# Altium project NIR_Spectroscopy.PrjPcb
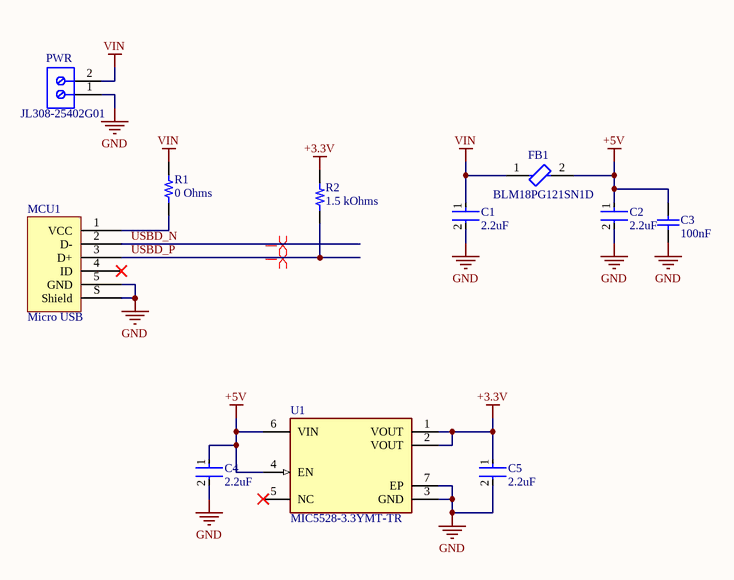
[diagram p0: Power.SchDoc]
4 sheets, 55 parts. Net scope: global (net labels, ports and power ports of the same name join across sheets).
Board file: Spectroscopy Board Rev1.PcbDoc
Sheets:
  Power.SchDoc
  uC.SchDoc
  ADC.SchDoc
  Photodiode Receiver.SchDoc

## Sheet Power.SchDoc
size A; SheetNumber: 1; SheetTotal: 2

### Parts
C1  2.2uF  [FP-CL10-IPC_A]
C2  2.2uF  [FP-CL10-IPC_A]
C3  100nF  [CAPC1050X55X23ML05T13]
C4  2.2uF  [FP-CL10-IPC_A]
C5  2.2uF  [FP-CL10-IPC_A]
FB1  BLM18PG121SN1D  [FP-BLM18-0_15-t0_8-IPC_A]
MCU1  Micro USB  [FCI USB 10118193-0001LF]
PWR  JL308-25402G01  [691210910002]
R1  0 Ohms  [RES 0805_2012]
R2  1.5 kOhms  [RES 0402_1005]
U1  MIC5528-3.3YMT-TR  [FP-TDFN1212-6LD-PL-1-MFG]

### Nets
+3.3V: C5.1 R2.2 U1.1(VOUT) U1.2(VOUT)
+5V: C2.1 C3.2 C4.1 FB1.2 U1.4(EN) U1.6(VIN)
GND: C1.2 C2.2 C3.1 C4.2 C5.2 MCU1.5(GND) MCU1.S(Shield) PWR.1 U1.3(GND) U1.7(EP)
VIN: C1.1 FB1.1 PWR.2 R1.1
USBD_N: MCU1.2(D-)
USBD_P: MCU1.3(D+) R2.1
NetMCU1_1: MCU1.1(VCC) R1.2

Not connected (* = marked no-connect by the designer): MCU1 4(ID)*; U1 5(NC)*

### Layout directives
differential pair: (no net found under the mark)

### Library data of the parts
C1 C2 C4 C5 = CMP-13271-000835-1: Cap Ceramic 2.2uF 16V X5R ±10% Pad SMD 0603 +85°C T/R; Case Code (Metric): 1608; Height: 0.8mm; Case/Package: 0603; Depth: 0.8mm; Capacitance: 2.2uF; Voltage Rating: 16V; Case Code (Imperial): 0603; Length: 1.6mm; Packaging: Tape and Reel; Material: Ceramic; Lead Free: Lead Free; Max Operating Temperature: 85°C; Contact Plating: Tin; Thickness: 0.035inch; Radiation Hardening: No; Tolerance: 10%; Min Operating Temperature: -55°C; Voltage: 16V; Dielectric: X5R; Mount: Surface Mount; Package Quantity: 4000; Width: 0.031inch; Voltage Rating (DC): 16V
C3 = CMP-2000-05439-1: Chip Capacitor, 100 nF, +/- 10%, 16 V, -55 to 125 degC, 0402 (1005 Metric), RoHS, Tape and Reel; Manufacturer: Samsung Electro-Mechanics; Capacitance: 100000pF; Dielectric: X7R; Rated Voltage: 16V; Case Size/Dimension: 0402; Tolerance (%): ±10%; Manufacturer URL: http://www.samsungsem.com/global/index.jsp; Datasheet URL: https://datasheet.ciiva.com/29198/458718-da-01-en-vs-kondensator-0402-29198423.pdf; Datasheet Version: Nov-10
FB1 = CMP-0686-00557-7: Chip Ferrite Bead, 0603, 120Ω @ 100MHz, 0.05Ω, 25%, 2A; Impedance: 120R; Number of Circuits: 1; Shielding: Unshielded; Material: Steel; DC Resistance (DCR): 50mR; Case Code (Imperial): 0603; RoHS Compliant: Yes; Number of Pins: 2; Min Operating Temperature: -55°C; Case Code (Metric): 1608; Frequency: 100MHz; Length: 1.6mm; Test Frequency: 100MHz; Max Operating Temperature: 125°C; Packaging: Tape and Reel; Max Current Rating: 2A; Termination: SMD/SMT; Lead Free: Lead Free; Max DC Current: 2A; Case/Package: 0603; Height: 0.8mm; Current Rating: 2A; Radiation Hardening: No; Core Material: Ferrite; DC Current: 2A; REACH SVHC: No SVHC; Package Quantity: 1; Depth: 0.8mm; Number of Lines: 1; Tolerance: 25%; Width: 0.8mm
MCU1 = 10118193-0001LF: CONN RCPT USB2.0 MICRO B SMD R/A; Manufacturer: Amphenol ICC (FCI); Connector Type: USB - micro B; Current Rating (Amps): 1.8A per Contact; Gender: Receptacle; Mating Cycles: 10000; Number of Contacts: 5; Number of Ports: 1; Shielding: Shielded; Voltage - Rated: 100VAC; Part Number: 10118193-0001LF; ComponentLink1Description: Datasheet; ComponentLink1URL: https://cdn.amphenol-icc.com/media/wysiwyg/files/documentation/datasheet/inputoutput/io_usb_micro.pdf; ComponentLink2Description: DigiKey Link; ComponentLink2URL: //digikey.com/product-detail/en/amphenol-icc-fci/10118193-0001LF/609-4616-2-ND/2785388; Features: Solder Retention; LastUpdated: 12/9/2019 8:51:28 PM; Lifecycle Status: 0; Minimum Order: 1; Mounting Feature: Horizontal; Mounting Type: Surface Mount, Right Angle; Through Hole; Operating Temperature: -30°C ~ 80°C; Packaging: TapeAndReel; Part Status: Active; Price: 0.21; Series: -; Specifications: USB 2.0; Supplier 1: DigiKey; Supplier Part Number 1: 609-4616-2-ND; Termination: Solder
PWR = CMP-1502-02456-2: Use comment for part number; NexarPartId: 105950649; Current Rating: 6A; Voltage Rating: 150V; Number of Contacts: 2; Number of Rows: 1; Contact Material: Tin; Height: 8.7mm; Max Operating Temperature: 105°C; Min Operating Temperature: -40°C
R1 = TLRZ2ATTD: 0805 0 ohm - use 0805W8F0000T5E; Manufacturer: KOA Speer Electronics, Inc.; Tolerance: Jumper; Part Number: TLRZ2ATTD; Value: 0 Ohms; ComponentLink1Description: Datasheet; ComponentLink1URL: http://www.koaspeer.com/catimages/Products/TLRZ/TLRZ.pdf; ComponentLink2Description: DigiKey Link; ComponentLink2URL: https://www.digikey.com/en/products/detail/koa-speer-electronics-inc/TLRZ2ATTD/9845494; Composition: Metal Element; Device Package: 0805 (2012 Metric); Features: Automotive AEC-Q200, Current Sense; Height - Seated (Max): 0.022" (0.55mm); LastUpdated: 2/8/2024 9:02:39 PM; Lifecycle Status: Active; Minimum Order: 1; Number of Terminations: 2; Operating Temperature: -55°C ~ 170°C; Package / Case: 0805 (2012 Metric); Packaging: TapeAndReel; PartId: 27685; Part Status: Active; Price: 0.08; Ratings: AEC-Q200; Resistance: 0 Ohms; Series: TLRZ; Size / Dimension: 0.079" L x 0.049" W (2.00mm x 1.25mm); Supplier 1: DigiKey; Supplier Part Number 1: 2019-TLRZ2ATTDCT-ND; Supplier Device Package: 0805
R2 = RMCF0402FT1K50: RES 1.5K OHM 1% 1/16W 0402; Manufacturer: Stackpole Electronics Inc; Power (Watts): 0.063W, 1/16W; Temperature Coefficient: ±100ppm/°C; Part Number: RMCF0402FT1K50; Value: 1.5 kOhms; ComponentLink1Description: Datasheet; ComponentLink1URL: https://www.seielect.com/catalog/sei-rmcf_rmcp.pdf; ComponentLink2Description: DigiKey Link; ComponentLink2URL: https://www.digikey.com/en/products/detail/stackpole-electronics-inc/RMCF0402FT1K50/1761791; Composition: Thick Film; Device Package: 0402 (1005 Metric); Features: Automotive AEC-Q200; Height - Seated (Max): 0.016" (0.40mm); LastUpdated: 2/9/2024 8:30:13 PM; Lifecycle Status: Active; Minimum Order: 1; Number of Terminations: 2; Operating Temperature: -55°C ~ 155°C; Package / Case: 0402 (1005 Metric); Packaging: CutTape; PartId: 4934; Part Status: Active; Price: 0.01; Ratings: AEC-Q200; Resistance: 1.5 kOhms; Series: RMCF; Size / Dimension: 0.039" L x 0.020" W (1.00mm x 0.50mm); Supplier 1: DigiKey; Supplier Part Number 1: RMCF0402FT1K50CT-ND; Supplier Device Package: 0402; Tolerance: ±1%
U1 = CMP-06324-000078-1: IC REG LINEAR 3.3V 500MA 6TDFN; Dropout Voltage: 260mV; Number of Regulators: 1; Min Current Limit: 525mA; Output Current: 500mA; Output Voltage: 3.3V; Max Operating Temperature: 125°C; Packaging: Tape and Reel; Mount: Surface Mount; Min Operating Temperature: -40°C

## Sheet uC.SchDoc
size A; SheetNumber: 2; SheetTotal: 5
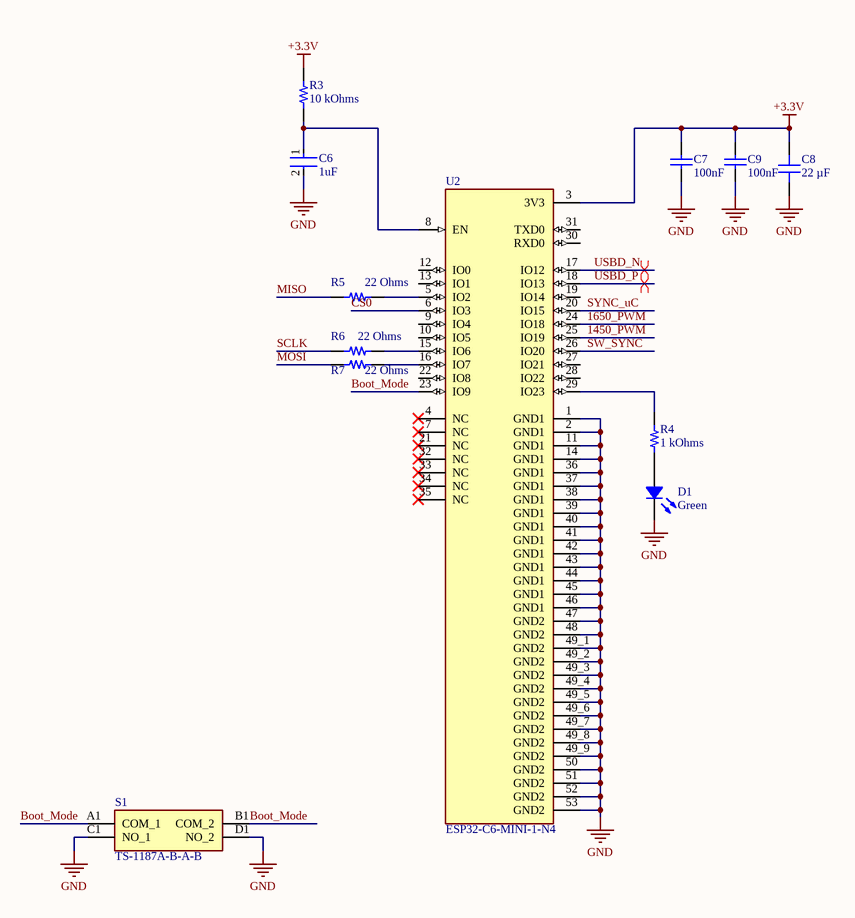
[diagram p1: uC.SchDoc]

### Parts
C6  1uF  [FP-CL542-IPC_C]
C7  100nF  [CAPC1050X55X23ML05T13]
C8  22 µF  [CAP 0603_1608]
C9  100nF  [CAPC1050X55X23ML05T13]
D1  Green  [LED 0805_2012 GREEN]
R3  10 kOhms  [RES 0402_1005]
R4  1 kOhms  [RES 0402_1005]
R5  22 Ohms  [RES 0402_1005]
R6  22 Ohms  [RES 0402_1005]
R7  22 Ohms  [RES 0402_1005]
S1  TS-1187A-B-A-B  [TS1187ABAB]
U2  ESP32-C6-MINI-1-N4  [XCVR_ESP32-C6-MINI-1-N4]

### Nets
+3.3V: C7.2 C8.2 C9.2 R3.2 U2.3(3V3)
GND: C6.2 C7.1 C8.1 C9.1 D1.2 S1.C1(NO_1) S1.D1(NO_2) U2.1(GND1) U2.2(GND1) U2.11(GND1) U2.14(GND1) U2.36(GND1) U2.37(GND1) U2.38(GND1) U2.39(GND1) U2.40(GND1) U2.41(GND1) U2.42(GND1) U2.43(GND1) U2.44(GND1) U2.45(GND1) U2.46(GND1) U2.47(GND2) U2.48(GND2) U2.49_1(GND2) U2.49_2(GND2) U2.49_3(GND2) U2.49_4(GND2) U2.49_5(GND2) U2.49_6(GND2) U2.49_7(GND2) U2.49_8(GND2) U2.49_9(GND2) U2.50(GND2) U2.51(GND2) U2.52(GND2) U2.53(GND2)
1450_PWM: U2.25(IO19)
1650_PWM: U2.24(IO18)
Boot_Mode: S1.A1(COM_1) S1.B1(COM_2) U2.23(IO9)
CS0: U2.6(IO3)
MISO: R5.1
MOSI: R7.1
SCLK: R6.1
SW_SYNC: U2.26(IO20)
SYNC_uC: U2.20(IO15)
USBD_N: U2.17(IO12)
USBD_P: U2.18(IO13)
NetC6_1: C6.1 R3.1 U2.8(EN)
NetD1_1: D1.1 R4.1
NetR4_2: R4.2 U2.29(IO23)
NetR5_2: R5.2 U2.5(IO2)
NetR6_2: R6.2 U2.15(IO6)
NetR7_2: R7.2 U2.16(IO7)

Not connected (* = marked no-connect by the designer): U2 4(NC)* 7(NC)* 9(IO4) 10(IO5) 12(IO0) 13(IO1) 19(IO14) 21(NC)* 22(IO8) 27(IO21) 28(IO22) 30(RXD0) 31(TXD0) 32(NC)* 33(NC)* 34(NC)* 35(NC)*

### Layout directives
differential pair: USBD_N, USBD_P

### Library data of the parts
C6 = CMP-13271-001051-1: Cap Ceramic 1uF 25V X5R ±10% SMD 0402 +85°C Paper T/R; Radiation Hardening: No; Lead Free: Lead Free; Capacitance: 1uF; Package Quantity: 10000; Max Operating Temperature: 85°C; Voltage Rating: 25V; Case/Package: 0402; Min Operating Temperature: -55°C; Packaging: Tape and Reel; Tolerance: 10%; Height: 0.5mm; Thickness: 0.022inch; Case Code (Metric): 1005; Width: 0.02inch; Case Code (Imperial): 0402; Dielectric: X5R; Length: 1mm; Mount: Surface Mount; Material: Ceramic; Depth: 0.5mm
C7 C9 = CMP-2000-05439-1: as C3 on sheet Power; Case Size/Dimension: 0402; Tolerance (%): ±10%; Manufacturer URL: http://www.samsungsem.com/global/index.jsp; Datasheet URL: https://datasheet.ciiva.com/29198/458718-da-01-en-vs-kondensator-0402-29198423.pdf; Datasheet Version: Nov-10
C8 = CL10A226KQ8NRNE: CAP CER 22UF 6.3V X5R 0603; manufacturer: Samsung Electro-Mechanics; Tolerance: ±10%; Part Number: CL10A226KQ8NRNE; Value: 22 µF; Applications: General Purpose; Capacitance: 22 µF; componentlink1description: Datasheet; componentlink1url: http://www.samsungsem.com/kr/support/product-search/mlcc/CL10A226KQ8NRNE.jsp; componentlink2description: DigiKey Link; componentlink2url: https://www.digikey.com/en/products/detail/samsung-electro-mechanics/CL10A226KQ8NRNE/3888525; Device Package: 0603 (1608 Metric); lastupdated: 2/9/2024 8:10:30 PM; Lifecycle Status: Active; Minimum Order: 1; Mounting Type: Surface Mount, MLCC; Operating Temperature: -55°C ~ 85°C; Package / Case: 0603 (1608 Metric); packaging: TapeAndReel; partid: 2682; Part Status: Active; price: 0.10; series: CL; Size / Dimension: 0.063" L x 0.031" W (1.60mm x 0.80mm); Supplier 1: DigiKey; Supplier Part Number 1: 1276-2867-1-ND; Temperature Coefficient: X5R; Thickness (Max): 0.035" (0.90mm); Voltage - Rated: 6.3V
D1 = SM0805GC: LED GREEN CLEAR 0805 SMD KT0805G; Manufacturer: Bivar Inc.; Configuration: Standard; Current - Test: 20mA; Lens Color: Colorless; Lens Size: 1.40mm x 1.20mm; Lens Style: Rectangle with Flat Top; Millicandela Rating: 15mcd; Viewing Angle: 130°; Voltage - Forward (Vf) (Typ): 2.1V; Wavelength - Dominant: 565nm; Wavelength - Peak: 568nm; Part Number: SM0805GC; Color: Green; ComponentLink1Description: Datasheet; ComponentLink1URL: https://www.bivar.com/Files/Datasheets/SM0805GC.pdf; ComponentLink2Description: DigiKey Link; ComponentLink2URL: https://www.digikey.com/en/products/detail/bivar-inc/SM0805GC/3095526; Device Package: 0805 (2012 Metric); Height (Max): 1.10mm; LastUpdated: 6/3/2024 8:00:29 PM; Lens Transparency: Clear; Lifecycle Status: Active; Minimum Order: 1; Mounting Type: Surface Mount; Package / Case: 0805 (2012 Metric); Packaging: TapeAndReel; PartId: 266; Part Status: Active; Price: 0.28; Series: -; Size / Dimension: 2.00mm L x 1.20mm W; Supplier 1: DigiKey; Supplier Part Number 1: 492-1696-1-ND; Supplier Device Package: 0805; Value: Green
R3 = CRCW040210K0FKEE: RES SMD 10K OHM 1% 1/16W 0402; Manufacturer: Vishay Dale; Power (Watts): 0.063W, 1/16W; Temperature Coefficient: ±100ppm/°C; Part Number: CRCW040210K0FKEE; Value: 10 kOhms; ComponentLink1Description: Datasheet; ComponentLink1URL: http://www.vishay.com/docs/20035/dcrcwe3.pdf; ComponentLink2Description: DigiKey Link; ComponentLink2URL: https://www.digikey.com/en/products/detail/vishay-dale/CRCW040210K0FKEE/5069897; Composition: Thick Film; Device Package: 0402 (1005 Metric); Features: Automotive AEC-Q200; Height - Seated (Max): 0.016" (0.40mm); LastUpdated: 2/9/2024 8:30:20 PM; Lifecycle Status: Active; Minimum Order: 1; Number of Terminations: 2; Operating Temperature: -55°C ~ 155°C; Package / Case: 0402 (1005 Metric); Packaging: CutTape; PartId: 3471; Part Status: Active; Price: 0.01; Ratings: AEC-Q200; Resistance: 10 kOhms; Series: CRCW; Size / Dimension: 0.039" L x 0.020" W (1.00mm x 0.50mm); Supplier 1: DigiKey; Supplier Part Number 1: 541-2954-1-ND; Supplier Device Package: 0402; Tolerance: ±1%
R4 = CPF0402B1K0E: RES SMD 1K OHM 0.1% 1/16W 0402; Manufacturer: TE Connectivity Passive Product; Power (Watts): 0.063W, 1/16W; Temperature Coefficient: ±25ppm/°C; Part Number: CPF0402B1K0E; Value: 1 kOhms; ComponentLink1Description: Datasheet; ComponentLink1URL: https://www.te.com/commerce/DocumentDelivery/DDEController?Action=srchrtrv&DocNm=1773200&DocType=DS&DocLang=English; ComponentLink2Description: DigiKey Link; ComponentLink2URL: https://www.digikey.com/en/products/detail/te-connectivity-passive-product/CPF0402B1K0E/4966468; Composition: Thin Film; Device Package: 0402 (1005 Metric); Height - Seated (Max): 0.014" (0.35mm); LastUpdated: 2/9/2024 8:30:24 PM; Lifecycle Status: Active; Minimum Order: 1; Number of Terminations: 2; Operating Temperature: -55°C ~ 155°C; Package / Case: 0402 (1005 Metric); Packaging: TapeAndReel; PartId: 2470; Part Status: Active; Price: 0.10; Resistance: 1 kOhms; Series: CPF, Neohm; Size / Dimension: 0.039" L x 0.020" W (1.00mm x 0.50mm); Supplier 1: DigiKey; Supplier Part Number 1: A119928CT-ND; Supplier Device Package: 0402; Tolerance: ±0.1%
R5-R7 = RR0510R-220-D: RES SMD 22 OHM 0.5% 1/16W 0402; Manufacturer: Susumu; Power (Watts): 0.063W, 1/16W; Temperature Coefficient: ±100ppm/°C; Part Number: RR0510R-220-D; Value: 22 Ohms; ComponentLink1Description: Datasheet; ComponentLink1URL: http://www.susumu.co.jp/common/pdf/n_catalog_partition05_en.pdf; ComponentLink2Description: DigiKey Link; ComponentLink2URL: https://www.digikey.com/en/products/detail/susumu/RR0510R-220-D/567231; Composition: Thin Film; Device Package: 0402 (1005 Metric); Height - Seated (Max): 0.016" (0.40mm); LastUpdated: 2/9/2024 8:30:21 PM; Lifecycle Status: Active; Minimum Order: 1; Number of Terminations: 2; Operating Temperature: -55°C ~ 125°C; Package / Case: 0402 (1005 Metric); Packaging: TapeAndReel; PartId: 3266; Part Status: Active; Price: 0.01; Resistance: 22 Ohms; Series: RR; Size / Dimension: 0.039" L x 0.020" W (1.00mm x 0.50mm); Supplier 1: DigiKey; Supplier Part Number 1: RR05R22DCT-ND; Tolerance: ±0.5%
S1 = TS-1187A-B-A-B: Switch; Manufacturer_Name: XKB Connectivity; Datasheet Link: http://www.helloxkb.com/public/images/pdf/TS-1187A-X-X-X.pdf; Height: 4.05mm; Manufacturer_Part_Number: TS-1187A-B-A-B
U2 = ESP32-C6-MINI-1-N4: 802.15.4, Bluetooth, WiFi 802.11ax, Bluetooth v5.0, ZigbeeÂ® Transceiver Module 2.4GHz Antenna Not Included Surface Mount; MF: Espressif Systems; SnapEDA_Link: https://www.snapeda.com/parts/ESP32-C6-MINI-1-N4/Espressif+Systems/view-part/?ref=snap; Package: SMD-53 Espressif Systems; Value: *; MP: ESP32-C6-MINI-1-N4; Check_prices: https://www.snapeda.com/parts/ESP32-C6-MINI-1-N4/Espressif+Systems/view-part/?ref=eda

## Sheet ADC.SchDoc
size A; SheetNumber: 3; SheetTotal: 5
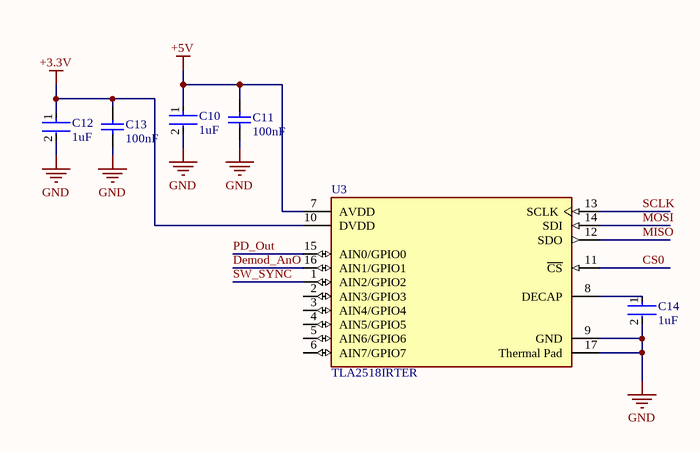
[diagram p2: ADC.SchDoc]

### Parts
C10  1uF  [FP-CL542-IPC_C]
C11  100nF  [CAPC1050X55X23ML05T13]
C12  1uF  [FP-CL542-IPC_C]
C13  100nF  [CAPC1050X55X23ML05T13]
C14  1uF  [FP-CL542-IPC_C]
U3  TLA2518IRTER  [FP-RTE0016C-MFG]

### Nets
+3.3V: C12.1 C13.2 U3.10(DVDD)
+5V: C10.1 C11.2 U3.7(AVDD)
GND: C10.2 C11.1 C12.2 C13.1 C14.2 U3.9(GND) U3.17(Thermal_Pad)
CS0: U3.11(~{CS})
Demod_AnO: U3.16(AIN1/GPIO1)
MISO: U3.12(SDO)
MOSI: U3.14(SDI)
PD_Out: U3.15(AIN0/GPIO0)
SCLK: U3.13(SCLK)
SW_SYNC: U3.1(AIN2/GPIO2)
NetC14_1: C14.1 U3.8(DECAP)

Not connected (* = marked no-connect by the designer): U3 2(AIN3/GPIO3) 3(AIN4/GPIO4) 4(AIN5/GPIO5) 5(AIN6/GPIO6) 6(AIN7/GPIO7)

### Library data of the parts
C10 C12 C14 = CMP-13271-001051-1: as C6 on sheet uC; Radiation Hardening: No; Lead Free: Lead Free; Capacitance: 1uF; Package Quantity: 10000; Max Operating Temperature: 85°C; Voltage Rating: 25V; Case/Package: 0402; Min Operating Temperature: -55°C; Packaging: Tape and Reel; Tolerance: 10%; Height: 0.5mm; Thickness: 0.022inch; Case Code (Metric): 1005; Width: 0.02inch; Case Code (Imperial): 0402; Dielectric: X5R; Length: 1mm; Mount: Surface Mount; Material: Ceramic; Depth: 0.5mm
C11 C13 = CMP-2000-05439-1: as C3 on sheet Power; Case Size/Dimension: 0402; Tolerance (%): ±10%; Manufacturer URL: http://www.samsungsem.com/global/index.jsp; Datasheet URL: https://datasheet.ciiva.com/29198/458718-da-01-en-vs-kondensator-0402-29198423.pdf; Datasheet Version: Nov-10
U3 = CMP-04860-000058-1: IC ADC 12BIT SAR 16WQFN

## Sheet Photodiode Receiver.SchDoc
size A; SheetNumber: 5; SheetTotal: 5
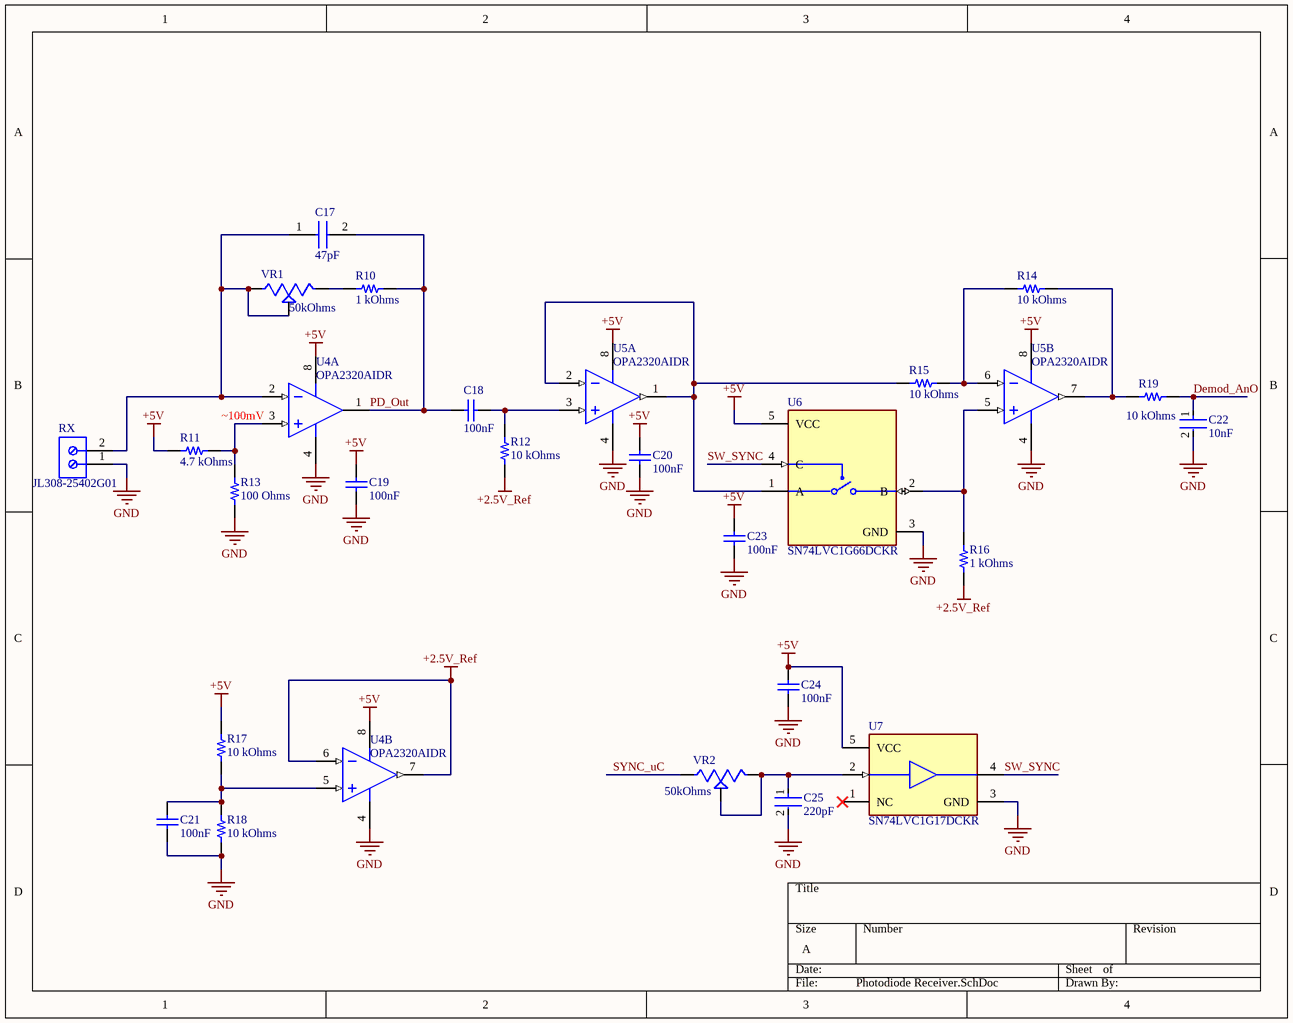
[diagram p3: Photodiode Receiver.SchDoc]

### Parts
C17  47pF  [CAPC1005X55N]
C18  100nF  [CAPC1050X55X23ML05T13]
C19  100nF  [CAPC1050X55X23ML05T13]
C20  100nF  [CAPC1050X55X23ML05T13]
C21  100nF  [CAPC1050X55X23ML05T13]
C22  10nF  [FP-CL165-IPC_C]
C23  100nF  [CAPC1050X55X23ML05T13]
C24  100nF  [CAPC1050X55X23ML05T13]
C25  220pF  [FP-CL10-IPC_A]
R10  1 kOhms  [RES 0402_1005]
R11  4.7 kOhms  [RES 0402_1005]
R12  10 kOhms  [RES 0402_1005]
R13  100 Ohms  [RES 0402_1005]
R14  10 kOhms  [RES 0402_1005]
R15  10 kOhms  [RES 0402_1005]
R16  1 kOhms  [RES 0402_1005]
R17  10 kOhms  [RES 0402_1005]
R18  10 kOhms  [RES 0402_1005]
R19  10 kOhms  [RES 0402_1005]
RX  JL308-25402G01  [691210910002]
U4  OPA2320AIDR  [D0008A_L]  (parts A,B of 2)
U5  OPA2320AIDR  [D0008A_L]  (parts A,B of 2)
U6  SN74LVC1G66DCKR  [FP-DCK0005A-MFG]
U7  SN74LVC1G17DCKR  [FP-DCK0005A-MFG]
VR1  50kOhms  [TRIM_3314J-1-503E]
VR2  50kOhms  [TRIM_3314J-1-503E]

### Nets
+2.5V_Ref: R12.1 R16.2 U4.6(IN_B-) U4.7(OUT_B)
+5V: C19.2 C20.2 C23.2 C24.2 R11.1 R17.2 U4.8(V+) U5.8(V+) U6.5(VCC) U7.5(VCC)
GND: C19.1 C20.1 C21.1 C22.2 C23.1 C24.1 C25.2 R13.1 R18.1 RX.1 U4.4(V-) U5.4(V-) U6.3(GND) U7.3(GND)
Demod_AnO: C22.1 R19.1
PD_Out: C17.2 C18.2 R10.1 U4.1(OUT_A)
SW_SYNC: U6.4(C) U7.4(Y)
SYNC_uC: VR2.3(CW)
NetC17_1: C17.1 RX.2 U4.2(IN_A-) VR1.2(WIPER) VR1.3(CW)
NetC18_1: C18.1 R12.2 U5.3(IN_A+)
NetC21_2: C21.2 R17.1 R18.2 U4.5(IN_B+)
NetC25_1: C25.1 U7.2(A) VR2.1(CCW) VR2.2(WIPER)
NetR10_2: R10.2 VR1.1(CCW)
NetR11_2: R11.2 R13.2 U4.3(IN_A+)
NetR14_1: R14.1 R19.2 U5.7(OUT_B)
NetR14_2: R14.2 R15.1 U5.6(IN_B-)
NetR15_2: R15.2 U5.1(OUT_A) U5.2(IN_A-) U6.1(A)
NetR16_1: R16.1 U5.5(IN_B+) U6.2(B)

Not connected (* = marked no-connect by the designer): U7 1(NC)*

### Notes on the sheet
- ~100mV

### Library data of the parts
C17 = 0402CG470J500NT: Capacitor 0402CG470J500NT; Manufacturer_Name: Guangdong Fenghua Advanced Tech; Datasheet Link: https://datasheet.lcsc.com/szlcsc/Guangdong-Fenghua-Advanced-Tech-0402CG470J500NT_C1567.pdf; Height: 0.55mm; Manufacturer_Part_Number: 0402CG470J500NT
C18-C21 C23 C24 = CMP-2000-05439-1: as C3 on sheet Power; Case Size/Dimension: 0402; Tolerance (%): ±10%; Manufacturer URL: http://www.samsungsem.com/global/index.jsp; Datasheet URL: https://datasheet.ciiva.com/29198/458718-da-01-en-vs-kondensator-0402-29198423.pdf; Datasheet Version: Nov-10
C22 = CMP-13271-000387-1: Cap Ceramic 10nF 50V X7R ±10% SMD 0402 +125°C Paper T/R; Depth: 0.5mm; Length: 1mm; Lead Free: Lead Free; Case Code (Metric): 1005; Width: 0.02inch; Min Operating Temperature: -55°C; Thickness: 0.022inch; Package Quantity: 1; Mount: Surface Mount; Height: 0.5mm; Voltage: 50V; Material: Ceramic; Tolerance: 10%; Case Code (Imperial): 0402; Radiation Hardening: No; Case/Package: 0402; Max Operating Temperature: 125°C; Voltage Rating (DC): 50V; Contact Plating: Tin; Packaging: Tape and Reel; Voltage Rating: 50V; Capacitance: 10nF; Dielectric: X7R
C25 = CMP-13271-000087-1: Cap Ceramic 220pF 50V X7R ±10% Pad SMD 0603 +125°C T/R; Voltage Rating: 50V; Case Code (Metric): 1608; Radiation Hardening: No; Dielectric: X7R; Mount: Surface Mount; Length: 1.6mm; Thickness: 0.035inch; Packaging: Tape and Reel; Height: 0.8mm; Depth: 0.8mm; Tolerance: 10%; Width: 0.031inch; Case Code (Imperial): 0603; Voltage: 50V; Material: Ceramic; Case/Package: 0603; Capacitance: 220pF; Max Operating Temperature: 125°C; Min Operating Temperature: -55°C; Contact Plating: Tin
R10 R16 = CPF0402B1K0E: as R4 on sheet uC; Part Number: CPF0402B1K0E; Value: 1 kOhms; ComponentLink1Description: Datasheet; ComponentLink1URL: https://www.te.com/commerce/DocumentDelivery/DDEController?Action=srchrtrv&DocNm=1773200&DocType=DS&DocLang=English; ComponentLink2Description: DigiKey Link; ComponentLink2URL: https://www.digikey.com/en/products/detail/te-connectivity-passive-product/CPF0402B1K0E/4966468; Composition: Thin Film; Device Package: 0402 (1005 Metric); Height - Seated (Max): 0.014" (0.35mm); LastUpdated: 2/9/2024 8:30:24 PM; Lifecycle Status: Active; Minimum Order: 1; Number of Terminations: 2; Operating Temperature: -55°C ~ 155°C; Package / Case: 0402 (1005 Metric); Packaging: TapeAndReel; PartId: 2470; Part Status: Active; Price: 0.10; Resistance: 1 kOhms; Series: CPF, Neohm; Size / Dimension: 0.039" L x 0.020" W (1.00mm x 0.50mm); Supplier 1: DigiKey; Supplier Part Number 1: A119928CT-ND; Supplier Device Package: 0402; Tolerance: ±0.1%
R11 = RR0510P-472-D: RES SMD 4.7K OHM 0.5% 1/16W 0402; Manufacturer: Susumu; Power (Watts): 0.063W, 1/16W; Temperature Coefficient: ±25ppm/°C; Part Number: RR0510P-472-D; Value: 4.7 kOhms; ComponentLink1Description: Datasheet; ComponentLink1URL: http://www.susumu.co.jp/common/pdf/n_catalog_partition05_en.pdf; ComponentLink2Description: DigiKey Link; ComponentLink2URL: https://www.digikey.com/en/products/detail/susumu/RR0510P-472-D/432413; Composition: Thin Film; Device Package: 0402 (1005 Metric); Height - Seated (Max): 0.016" (0.40mm); LastUpdated: 2/9/2024 8:30:21 PM; Lifecycle Status: Active; Minimum Order: 1; Number of Terminations: 2; Operating Temperature: -55°C ~ 125°C; Package / Case: 0402 (1005 Metric); Packaging: TapeAndReel; PartId: 3209; Part Status: Active; Price: 0.01; Resistance: 4.7 kOhms; Series: RR; Size / Dimension: 0.039" L x 0.020" W (1.00mm x 0.50mm); Supplier 1: DigiKey; Supplier Part Number 1: RR05P4.7KDCT-ND; Tolerance: ±0.5%
R12 R14 R15 R17-R19 = CRCW040210K0FKEE: as R3 on sheet uC; Part Number: CRCW040210K0FKEE; Value: 10 kOhms; ComponentLink1Description: Datasheet; ComponentLink1URL: http://www.vishay.com/docs/20035/dcrcwe3.pdf; ComponentLink2Description: DigiKey Link; ComponentLink2URL: https://www.digikey.com/en/products/detail/vishay-dale/CRCW040210K0FKEE/5069897; Composition: Thick Film; Device Package: 0402 (1005 Metric); Features: Automotive AEC-Q200; Height - Seated (Max): 0.016" (0.40mm); LastUpdated: 2/9/2024 8:30:20 PM; Lifecycle Status: Active; Minimum Order: 1; Number of Terminations: 2; Operating Temperature: -55°C ~ 155°C; Package / Case: 0402 (1005 Metric); Packaging: CutTape; PartId: 3471; Part Status: Active; Price: 0.01; Ratings: AEC-Q200; Resistance: 10 kOhms; Series: CRCW; Size / Dimension: 0.039" L x 0.020" W (1.00mm x 0.50mm); Supplier 1: DigiKey; Supplier Part Number 1: 541-2954-1-ND; Supplier Device Package: 0402; Tolerance: ±1%
R13 = RR0510P-101-D: RES SMD 100 OHM 0.5% 1/16W 0402; Manufacturer: Susumu; Power (Watts): 0.063W, 1/16W; Temperature Coefficient: ±25ppm/°C; Part Number: RR0510P-101-D; Value: 100 Ohms; ComponentLink1Description: Datasheet; ComponentLink1URL: http://www.susumu.co.jp/common/pdf/n_catalog_partition05_en.pdf; ComponentLink2Description: DigiKey Link; ComponentLink2URL: https://www.digikey.com/en/products/detail/susumu/RR0510P-101-D/432375; Composition: Thin Film; Device Package: 0402 (1005 Metric); Height - Seated (Max): 0.016" (0.40mm); LastUpdated: 2/9/2024 8:30:21 PM; Lifecycle Status: Active; Minimum Order: 1; Number of Terminations: 2; Operating Temperature: -55°C ~ 125°C; Package / Case: 0402 (1005 Metric); Packaging: TapeAndReel; PartId: 3205; Part Status: Active; Price: 0.01; Resistance: 100 Ohms; Series: RR; Size / Dimension: 0.039" L x 0.020" W (1.00mm x 0.50mm); Supplier 1: DigiKey; Supplier Part Number 1: RR05P100DCT-ND; Tolerance: ±0.5%
RX = CMP-1502-02456-2: as PWR on sheet Power; Number of Rows: 1; Contact Material: Tin; Height: 8.7mm; Max Operating Temperature: 105°C; Min Operating Temperature: -40°C
U4 U5 = CMP-0272-00771-3: Precision, 20 MHz, 0.9 pA Ib, RRIO, CMOS Operational Amplifier, 1.8 to 5.5 V, -40 to 125 degC, 8-pin SOIC (D8), Green (RoHS & no Sb/Br); Manufacturer: Texas Instruments; IIB(Max)(pA): 400; Iq per channel(Max)(mA): 1.6; Number of Channels: 2; Total Supply Voltage(Min)(+5V is 5, +/-5V is 10): 1.8; CMRR(Min)(dB): 100; Slew Rate(Typ)(V/us): 10; Vio (25C)(Max)(mV): 0.15; Total Supply Voltage(Max)(+5V is 5, +/-5V is 10): 5.5; Vn at 1kHz(Typ)(nV/rtHz): 8.5; Sub Family: High Output Current Amplifier (>=50mA), Low Input Bias Current Amp (<=10pA), Low Noise Amp (<=10nV/rtHz), Low Offset Voltage Amplifier (<=500uV), Low Supply Voltage Amplifier (<=2.7V), Precision Amplifier; Offset Drift(Typ)(uV/C): 1.5; Code_JEDEC: MS-012; Eco-Plan: Green (RoHS & no Sb/Br); ComponentLink3URL: http://www.ti.com/litv/pdf/msoi002j; PackageVersion: 4040047-3/M, 06/2011; ComponentLink2URL: http://www.ti.com/general/docs/lit/getliterature.tsp?genericPartNumber=OPA2320&fileType=pdf; DatasheetVersion: SBOS513D; ComponentLink3Description: Package Specification; Mounting Technology: Surface Mount; PackageReference: D0008A; PackageDescription: 8-Pin Plastic Small Outline, Body 4.9 x 3.9 mm, Pitch 1.27 mm; PartNumber: OPA2320AIDR; ComponentLink1Description: Manufacturer URL; ComponentLink1URL: http://www.ti.com/; ComponentLink2Description: Datasheet
U6 = CMP-0859-00385-4: IC SWITCH 1X1 SC70-5; Manufacturer: Texas Instruments; Throw Configuration: SPST-NO; Nominal Supply Current: 1uA; Max Supply Voltage: 5.5V; Standoff Height: 0mm; -3Db Bandwith: 300MHz; On State Resistance: 5.5Ω; Mux Demux Ratio: 1:1; Max Junction Temp: +150°C; Min Supply Voltage: 1.65V; Number Of Circuits: 1; Octopart: https://octopart.com/sn74lvc1g66dckr-texas+instruments-472215; Temperature Range Low: -40°C; Mouser Description: Analogue Switch, Single Channel, SPST, 1, 10 ohm, 1.65V to 5.5V, SC-70, 5; Height: 1.1mm; ComponentLink2Description: Datasheet; RoHS: TRUE; Package: DCK0005A; Manufacturer Part Number: SN74LVC1G66DCKR; Digikey Description: IC SWITCH 1X1 SC70-5; Temperature: -40°C to +85°C; Temperature Range High: +85°C; ComponentLink2URL: http://www.ti.com/lit/ds/symlink/sn74lvc1g66.pdf; Lead Free: Yes; Device Class L3: Analog Switches; Device Class L2: Interface ICs; Ambient Temperature Range High: +85°C; Ambient Temperature Range Low: -40°C; Category: IC; Automotive: No; Device Class L1: Integrated Circuits (ICs)
U7 = CMP-0859-00388-5: IC BUF NON-INVERT 5.5V SC70-5; Number of Elements: 1; Polarity: Non-Inverting; Low Level Output Current: 32mA; Propagation Delay: 11ns; Logic Function: Schmitt Trigger; Min Supply Voltage: 1.65V; Quiescent Current: 1.5uA; High Level Output Current: -32mA; Packaging: Tape and Reel; Number of Gates: 1; Number of Output Lines: 1; Package Quantity: 1; Radiation Hardening: No; Max Supply Voltage: 5.5V; Contact Plating: Gold; Number of Outputs: 1; Number of Channels: 1; Termination: SMD/SMT; REACH SVHC: No SVHC; Number of Inputs: 1; Turn-On Delay Time: 11ns; Min Operating Temperature: -40°C; Number of Bits: 1; Number of Input Lines: 1; Number of Bits per Element: 1; Case/Package: SC; Number of Pins: 5; Mount: Surface Mount; Lead Free: Lead Free; Max Operating Temperature: 125°C
VR1 VR2 = 3314J-1-503E: Trimmer, Cermet, Rest 50 Kilohms, SMD, 1 Turn, Pwr-Rtg 0.25W | Bourns 3314J-1-503E; SnapEDA_Link: https://www.snapeda.com/parts/3314J-1-503E/Bourns/view-part/?ref=snap; Package: NON STANDARD-4 Bourns; Value: *; MF: Bourns; MP: 3314J-1-503E; Check_prices: https://www.snapeda.com/parts/3314J-1-503E/Bourns/view-part/?ref=eda

## Nets that join several sheets
+3.3V: Power (C5.1 R2.2 U1.1 U1.2), uC (5 pins), ADC (C12.1 C13.2 U3.10)
+5V: Power (6 pins), ADC (C10.1 C11.2 U3.7), Photodiode Receiver (10 pins)
GND: Power (10 pins), uC (37 pins), ADC (7 pins), Photodiode Receiver (14 pins)
CS0: uC (U2.6), ADC (U3.11)
Demod_AnO: ADC (U3.16), Photodiode Receiver (C22.1 R19.1)
MISO: uC (R5.1), ADC (U3.12)
MOSI: uC (R7.1), ADC (U3.14)
PD_Out: ADC (U3.15), Photodiode Receiver (C17.2 C18.2 R10.1 U4.1)
SCLK: uC (R6.1), ADC (U3.13)
SW_SYNC: uC (U2.26), ADC (U3.1), Photodiode Receiver (U6.4 U7.4)
SYNC_uC: uC (U2.20), Photodiode Receiver (VR2.3)
USBD_N: Power (MCU1.2), uC (U2.17)
USBD_P: Power (MCU1.3 R2.1), uC (U2.18)